# EAGLE design fpc_cable (EAGLE 9.6.2)
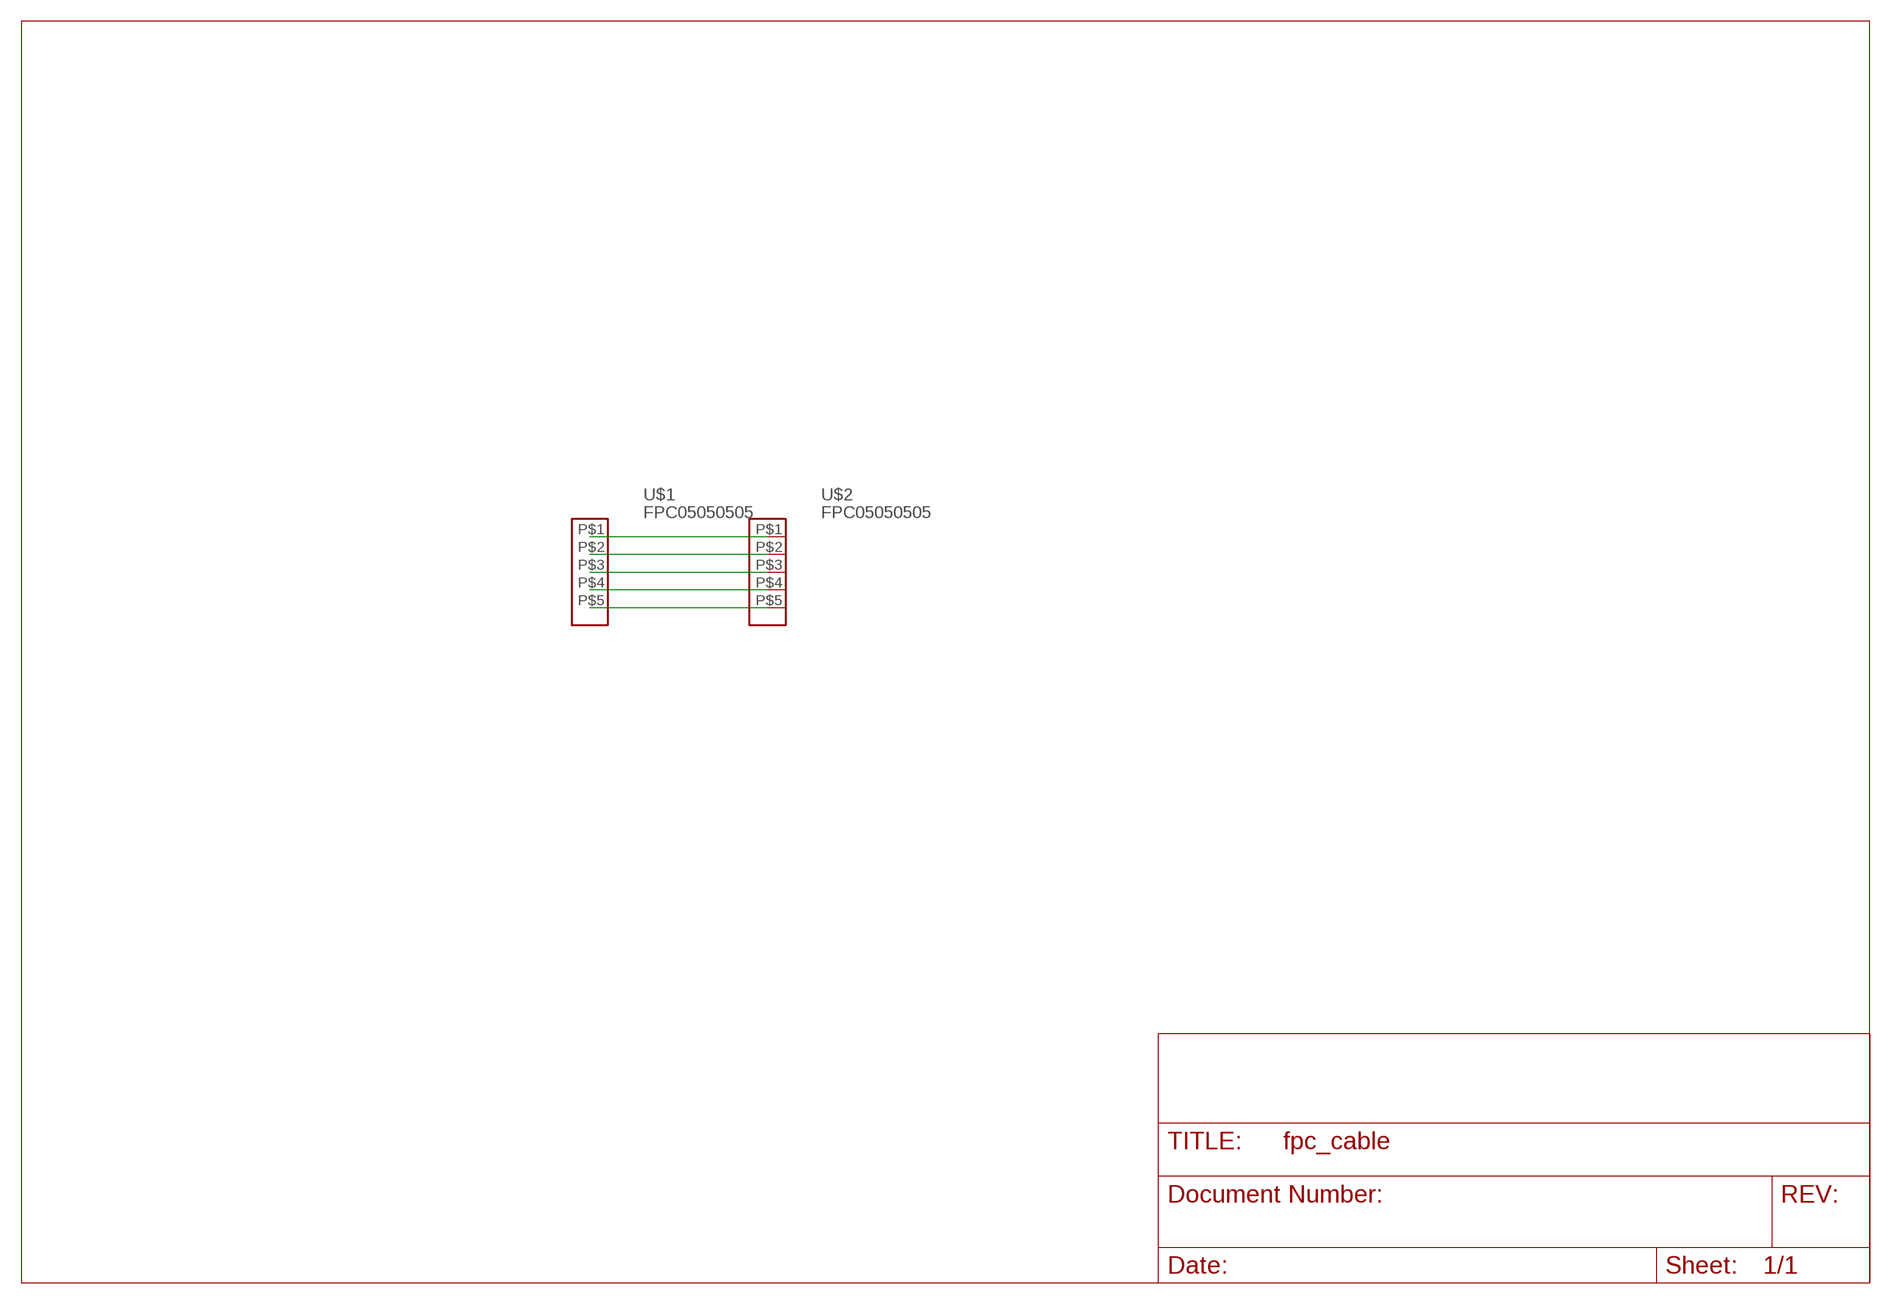
[diagram p0: schematic, sheet 1]

## Parts
U$1  FPC05050505  [FPB0505]
U$2  FPC05050505  [FPB0505]

## Nets
N$1: U$1.P$1 U$2.P$1
N$2: U$1.P$2 U$2.P$2
N$3: U$1.P$3 U$2.P$3
N$4: U$1.P$4 U$2.P$4
N$5: U$1.P$5 U$2.P$5

## Library data of the parts
U$1 U$2 = my_library:FPC0505

## Board
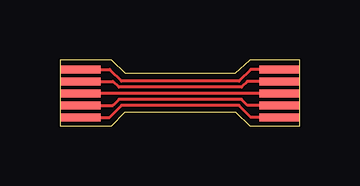
[diagram p1: board, top side]

Size 10.01 x 2.77 mm. Coordinates in mm from the lower left corner, seen from the top.
Outline: 0,0 2.16,0 2.72,0.6 7.32,0.6 7.92,0 10.01,0 10.01,2.77 7.92,2.77 7.32,2.21 2.72,2.21 2.16,2.77 0,2.77 0,0
Copper layers (1*16): Top 0.035mm / dielectric 1.6mm / Bottom 0.035mm
Design rules "jlcpcb-2layers": minimum track width 5mil, minimum drill 0.3mm, track to track 5mil, track to pad 5mil, pad to pad 5mil, via to via 5mil, smd to smd 5mil, copper to edge 0.2mm, drill to drill 6mil, minimum pad ring 10mil, minimum via ring 3mil, stop-mask expansion 4mil, vias tented up to drill 0mil, thermal gap 10mil

### Footprints (pad centres in the part's own frame; a part is rotated, then mirrored left to right if it is on the bottom)
FPB0505 = smd 0.3 x 1.7: P$1 -1,0.1; P$2 -0.5,0.1; P$3 0,0.1; P$4 0.5,0.1; P$5 1,0.1

### Placement (x,y rotation side)
U$1  0.95,1.37 90 top
U$2  9.26,1.37 90 top

### Tracks (layer width: path | path; a pad name or v marks a point on that pad's centre or on a via)
N$1
  Top 0.127: U$1.P$1 2.07,0.37 2.56,0.86 7.47,0.86 7.96,0.37 U$2.P$1 9.14,0.36
N$2
  Top 0.127: U$1.P$2 2.21,0.87 2.46,1.12 7.57,1.12 7.83,0.86 U$2.P$2
N$3
  Top 0.127: U$2.P$3 U$1.P$3
N$4
  Top 0.127: 9.15,1.88 U$2.P$4 7.82,1.87 7.57,1.63 2.46,1.63 2.21,1.87 U$1.P$4
N$5
  Top 0.127: 0.86,2.39 U$1.P$5 2.07,2.37 2.56,1.88 7.47,1.88 7.96,2.37 U$2.P$5